# Altium schematic sheet POWERR.SchDoc
size A4; SheetNumber: 3; SheetTotal: 3
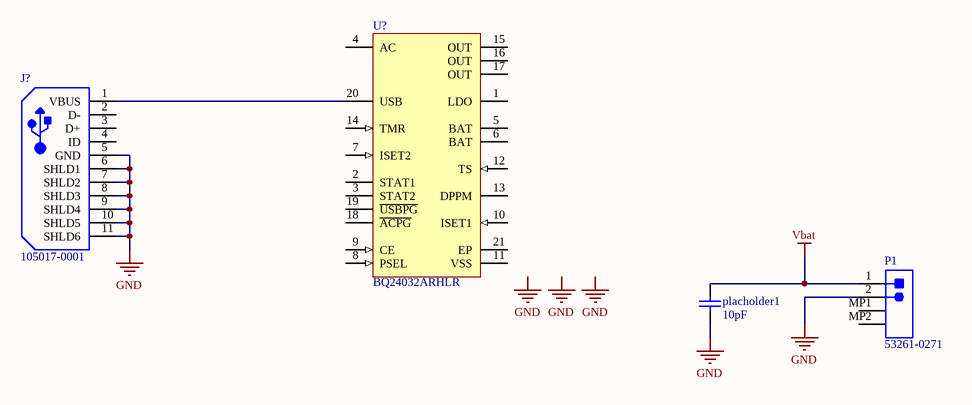
[diagram p0: POWERR.SchDoc]

## Parts
J?  105017-0001  [USB-MICRO-B_V]
P1  53261-0271  [MOLX-53261-0271_V]
placholder1  value 10pF  [CAPC1608X92X38LL15T08]  (hidden comment: VJ0603D3R9CXPAJ)
U?  BQ24032ARHLR  [RHL0020A_V]

## Nets
GND: J?.5(GND) J?.6(SHLD1) J?.7(SHLD2) J?.8(SHLD3) J?.9(SHLD4) J?.10(SHLD5) J?.11(SHLD6) P1.2 placholder1.2
Vbat: P1.1 placholder1.1
NetJ?_1: J?.1(VBUS) U?.20(USB)

Not connected (* = marked no-connect by the designer): J? 2(D-) 3(D+) 4(ID); P1 MP1 MP2; U? 1(LDO) 2(STAT1) 3(STAT2) 4(AC) 5(BAT) 6(BAT) 7(ISET2) 8(PSEL) 9(CE) 10(ISET1) 11(VSS) 12(TS) 13(DPPM) 14(TMR) 15(OUT) 16(OUT) 17(OUT) 18(~{ACPG}) 19(~{USBPG}) 21(EP)

## Notes on the sheet
- Labels drawn without touching a wire or pin: GND

## Library data of the parts
J? = CMP-2000-05827-1: Micro-USB B Receptacle, Right Angle, Bottom Mount, Surface Mount, with Solder Tabs, -30 to 85 degC, 5-Pin USB, RoHS, Tape and Reel; Manufacturer: Molex; Featured Product: Micro-USBConnectorsUSBConnectors; Other Names: WM1399DKR; Package Version: Rev. F, 12/2012; Number of Contacts: 5; Connector Type: USB-microB; Catalog Drawings: 1050170001; 3D Model: 105017-0001.stp; Mating Products: WM17145-ND-CABLEMICROUSBBTOSTDA1.0MWM17147-ND-CABLEMICROUSBBTOSTDA2.0MWM17146-ND-CABLEMICROUSBBTOSTDA1.5M; PCN Assembly/Origin: ResinSupplier21/Oct/2015; Voltage - Max: 30V; Online Catalog: Molex-MicroUSB; Manufacturer URL: http://www.molex.com/; Package Description: 5-Leads USB, Micro B, Body 7.5 x 5 mm, Pitch 0.65 mm; Datasheet URL: http://www.molex.com/elqNow/elqRedir.htm?ref=http://www.molex.com/webdocs/datasheets/pdf/en-us/1050170001_IO_CONNECTORS.pdf; Ingress Protection: -; Datasheet Version: 03/2016; Mounting Type: BoardCutout,SurfaceMount,RightAngle; Circuits: 5; Standard Package: 1; Package Reference: MICRO-B; Package URL: http://www.molex.com/pdm_docs/sd/1050170001_sd.pdf; Category: Connectors,Interconnects; Series: -; RoHS Information: 1050170001CertofCompliance; Features: Shielded,SolderRetention; Family: USB,DVI,HDMIConnectors; Specifications: -; Gender: Receptacle; Packaging: Digi-Reel®; Mounting Technology: SurfaceMount
P1 = CMP-2000-05633-1: PicoBlade(TM) Header, Right Angle, -40 to 85 degC, 2-Pin SMD, RoHS, Tape and Reel; Current - Max: 1A; Brand: Molex; Voltage Rating: 125V; Number of Positions: 2; Pitch: 1.25mm; Package Version: Rev. H, 11/2014; Factory Pack Quantity: 1000; Datasheet URL: http://www.molex.com/webdocs/datasheets/pdf/en-us/0532610271_PCB_HEADERS.pdf; Datasheet Version: 03/2016; Housing Material: Thermoplastic; RoHS: Details; Product Type: Headers; Number of Rows: 1; Termination Style: SMD; Mounting Technology: SurfaceMount; Number of Positions / Contacts: 2; Package URL: http://www.molex.com/pdm_docs/sd/532610271_sd.pdf; Mounting Angle: Right; Mounting Style: SMD/SMT; Manufacturer: Molex; Product Category: 1.25mmConnectors; Tradename: PicoBlade; Voltage - Max: 125V; Manufacturer URL: http://www.molex.com/; Series: 53261; Package Description: 2-Leads Header, Pitch 1.25 mm, Mated Height 3.4 mm; Package Reference: 53261-0271; Current Rating: 1A; Contact Plating: Tin; Contact Material: PhosphorBronze; Type: Shrouded; Packaging: Reel
placholder1 = CMP-2006-01519-1: Manufacturer: Vitramon; Part Number: VJ0603D3R9CXPAJ
U? = CMP-0321-00146-2: Dual Input Li-Ion Charger with Dynamic Power Path, Output regulated to 4.4 V, Vbat 4.2 V, 4.3 V, -40 to 85 degC, 20-pin QFN (RHL), Green (RoHS & no Sb/Br); Manufacturer: Texas Instruments; Vin(Min)(V): 4.3; Li-Ion: Y; SubFamily: Battery Charge Management; NiCd: N; Mounting Technology: Surface Mount; DatasheetVersion: SLUS618H; PackageReference: RHL0020A; PartNumber: BQ24032ARHLR; Li-Polymer: Y; ComponentLink1Description: Datasheet; Over Voltage Protection: N; Eco-Plan: Green (RoHS & no Sb/Br); PackageVersion: revJ, Dec-2011; ComponentLink1URL: http://www.ti.com/general/docs/lit/getliterature.tsp?genericPartNumber=BQ24032A&fileType=pdf; Lead Acid: N; PackageDescription: 20-Leads Plastic Quad Flatpack No-Lead, 4.5 x 3.5 x 0.9 mm Body, 0.5 mm Pitch, Exposed Pad; NiMH: N